# Altium schematic sheet Quad Nand.SchDoc
size A4; DocumentNumber: 8; SheetNumber: ALT0056; SheetTotal: 21
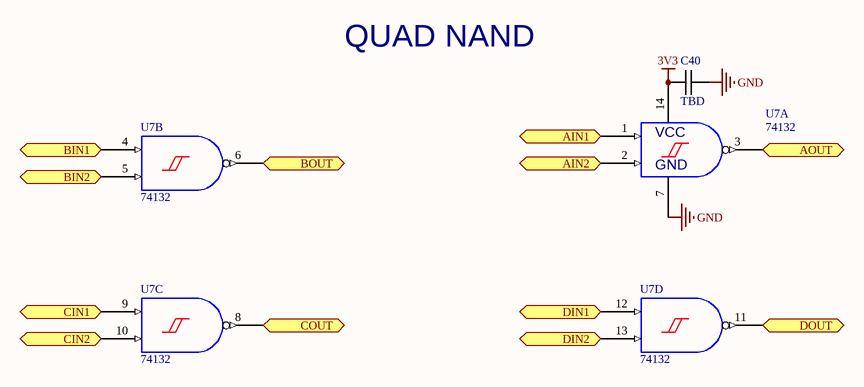
[diagram p0: Quad Nand.SchDoc]

## Parts
C40  TBD  [1210C-GENERIC]
U7  74132  [SSOP14]  (parts A,B,C,D of 4)

## Ports
AIN1 (in), AIN2 (in), AOUT (out), BIN1 (in), BIN2 (in), BOUT (out), CIN1 (in), CIN2 (in), COUT (out), DIN1 (in), DIN2 (in), DOUT (out)

## Nets
3V3: C40.1 U7.14(VCC)
GND: C40.2 U7.7(GND)
AIN1: U7.1 ; port AIN1
AIN2: U7.2 ; port AIN2
AOUT: U7.3 ; port AOUT
BIN1: U7.4 ; port BIN1
BIN2: U7.5 ; port BIN2
BOUT: U7.6 ; port BOUT
CIN1: U7.9 ; port CIN1
CIN2: U7.10 ; port CIN2
COUT: U7.8 ; port COUT
DIN1: U7.12 ; port DIN1
DIN2: U7.13 ; port DIN2
DOUT: U7.11 ; port DOUT

## Notes on the sheet
- QUAD NAND
- Title
- Size:
- Date:
- A4
- Number:
- Time:
- Revision:
- Sheet
- of
- File:

## Library data of the parts
C40 = Passives_Capacitors_1210_1210C-TBD: CAPACITOR 1210 CERAMIC VALUE TO BE DETERMINED
U7 = 74132: QUAD 2-IN POS NAND SCH